# EAGLE design nrf52840bob (EAGLE 8.6.0)
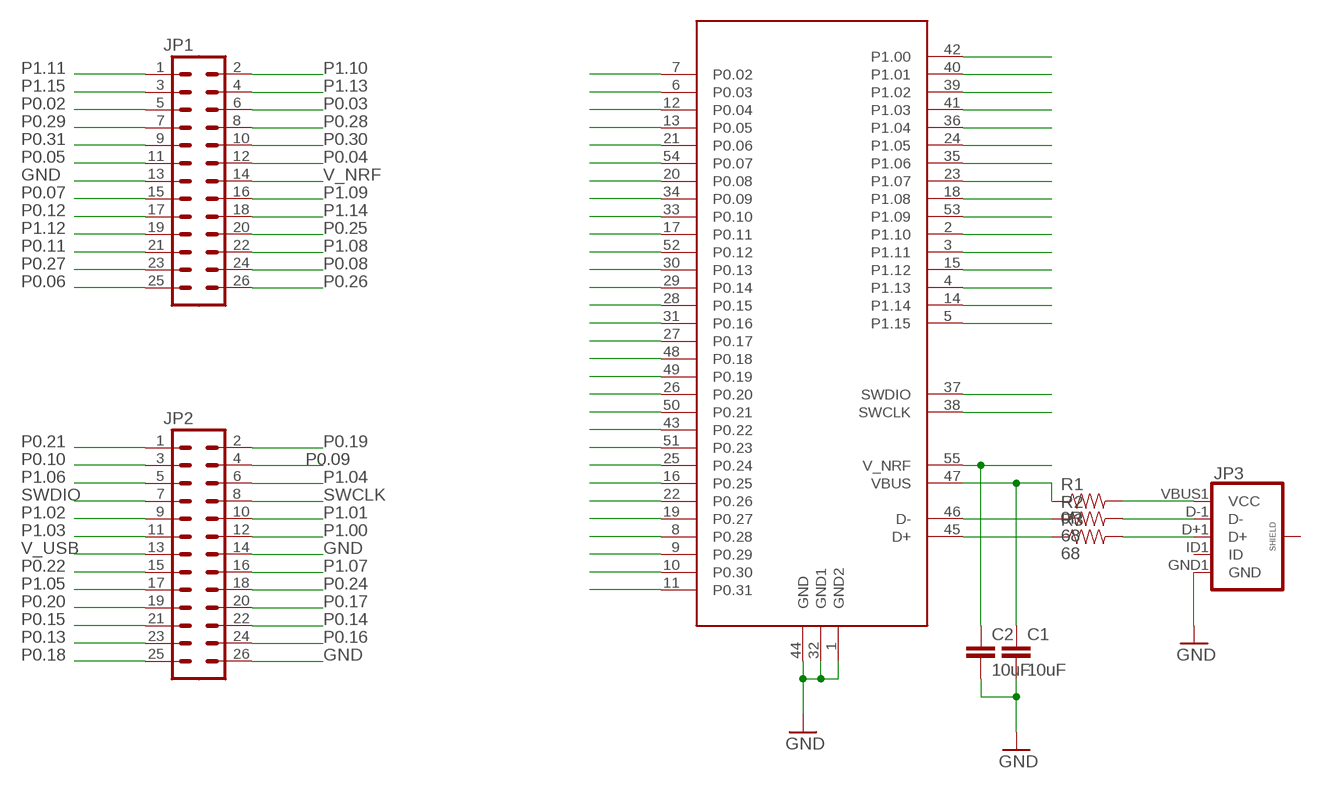
[diagram p0: schematic, sheet 1]

## Parts
C1  10uF  10UF-6.3V-20%(0603)  [0603-CAP]
C2  10uF  10UF-6.3V-20%(0603)  [0603-CAP]
JP1  M13X22X13  [2X13]
JP2  M13X22X13  [2X13]
JP3  USB_MICROB_PLUGCONN-11752  [USB-B-MICRO-SMD_V03]
R1  0R  RESISTOR0603-RES  [0603-RES]
R2  68  RESISTOR0603-RES  [0603-RES]
R3  68  RESISTOR0603-RES  [0603-RES]
U$1  NRF52840  [NRF52840MOD]

## Nets
GND: C1.2 C2.2 JP1.13 JP2.14 JP2.26 JP3.GND1(GND) U$1.1(GND2) U$1.32(GND1) U$1.44(GND)
N$48: R2.1 U$1.46(D-)
N$49: R3.1 U$1.45(D+)
N$50: JP3.D-1(D-) R2.2
N$51: JP3.D+1(D+) R3.2
N$53: C1.1 R1.1 U$1.47(VBUS)
P0.02: JP1.5 U$1.7(P0.02)
P0.03: JP1.6 U$1.6(P0.03)
P0.04: JP1.12 U$1.12(P0.04)
P0.05: JP1.11 U$1.13(P0.05)
P0.06: JP1.25 U$1.21(P0.06)
P0.07: JP1.15 U$1.54(P0.07)
P0.08: JP1.24 U$1.20(P0.08)
P0.09: JP2.4 U$1.34(P0.09)
P0.10: JP2.3 U$1.33(P0.10)
P0.11: JP1.21 U$1.17(P0.11)
P0.12: JP1.17 U$1.52(P0.12)
P0.13: JP2.23 U$1.30(P0.13)
P0.14: JP2.22 U$1.29(P0.14)
P0.15: JP2.21 U$1.28(P0.15)
P0.16: JP2.24 U$1.31(P0.16)
P0.17: JP2.20 U$1.27(P0.17)
P0.18: JP2.25 U$1.48(P0.18)
P0.19: JP2.2 U$1.49(P0.19)
P0.20: JP2.19 U$1.26(P0.20)
P0.21: JP2.1 U$1.50(P0.21)
P0.22: JP2.15 U$1.43(P0.22)
P0.23: U$1.51(P0.23)
P0.24: JP2.18 U$1.25(P0.24)
P0.25: JP1.20 U$1.16(P0.25)
P0.26: JP1.26 U$1.22(P0.26)
P0.27: JP1.23 U$1.19(P0.27)
P0.28: JP1.8 U$1.8(P0.28)
P0.29: JP1.7 U$1.9(P0.29)
P0.30: JP1.10 U$1.10(P0.30)
P0.31: JP1.9 U$1.11(P0.31)
P1.00: JP2.12 U$1.42(P1.00)
P1.01: JP2.10 U$1.40(P1.01)
P1.02: JP2.9 U$1.39(P1.02)
P1.03: JP2.11 U$1.41(P1.03)
P1.04: JP2.6 U$1.36(P1.04)
P1.05: JP2.17 U$1.24(P1.05)
P1.06: JP2.5 U$1.35(P1.06)
P1.07: JP2.16 U$1.23(P1.07)
P1.08: JP1.22 U$1.18(P1.08)
P1.09: JP1.16 U$1.53(P1.09)
P1.10: JP1.2 U$1.2(P1.10)
P1.11: JP1.1 U$1.3(P1.11)
P1.12: JP1.19 U$1.15(P1.12)
P1.13: JP1.4 U$1.4(P1.13)
P1.14: JP1.18 U$1.14(P1.14)
P1.15: JP1.3 U$1.5(P1.15)
SWCLK: JP2.8 U$1.38(SWCLK)
SWDIO: JP2.7 U$1.37(SWDIO)
V_NRF: C2.1 JP1.14 U$1.55(V_NRF)
V_USB: JP2.13 JP3.VBUS1(VCC) R1.2
Unconnected: JP3.ID1(ID) JP3.SHIELD1(SHIELD) JP3.SHIELD2(SHIELD) JP3.SHIELD3(SHIELD)

## Library data of the parts
C1 C2 = SparkFun-Capacitors:10UF-6.3V-20%(0603): CAP-11015; PROD_ID: CAP-11015
JP1 JP2 = SparkFun-Connectors:M13X2: 0.1" spaced headers
JP3 = SparkFun-Connectors:USB_MICROB_PLUG: USB Micro-B connectors Some male, some female. Watch your step!; PROD_ID: CONN-11752
R1-R3 = SparkFun-Passives:RESISTOR: Resistor Basic schematic elements and footprints for 0603, 1206, and PTH resistors.
U$1 = nrf52840mod:NRF52840

## Board
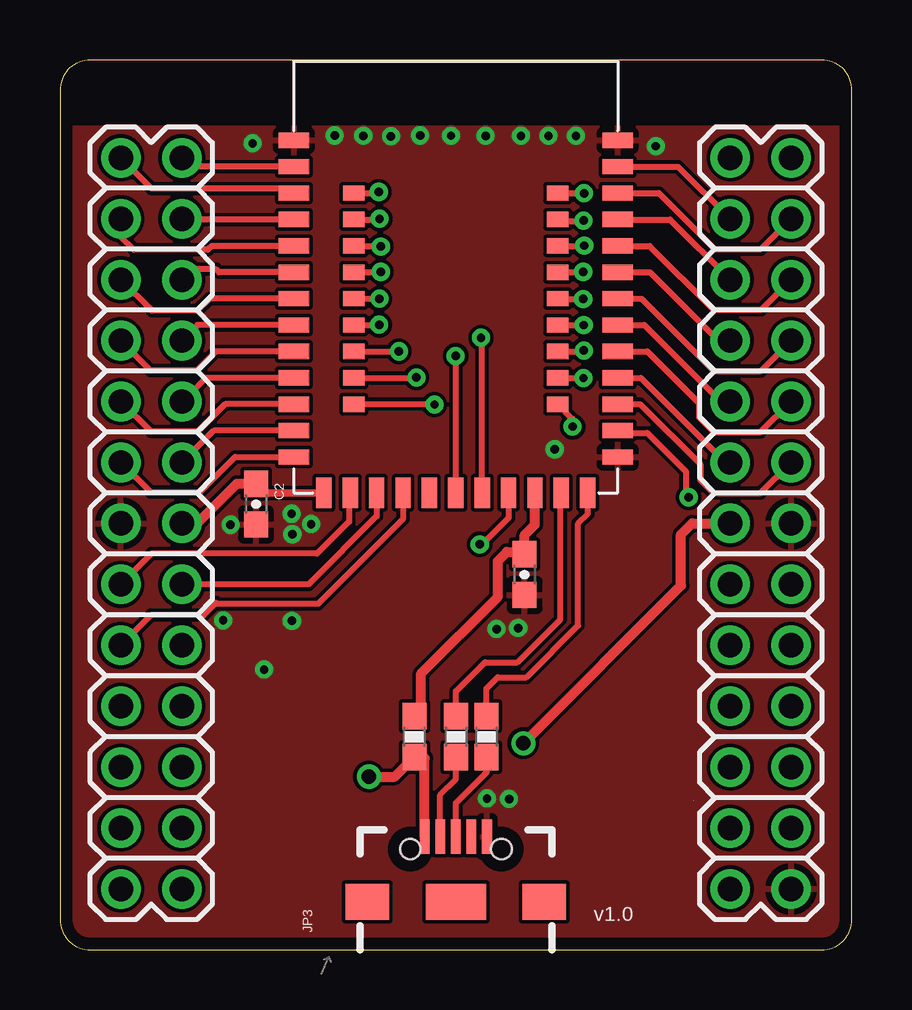
[diagram p1: board, top side]
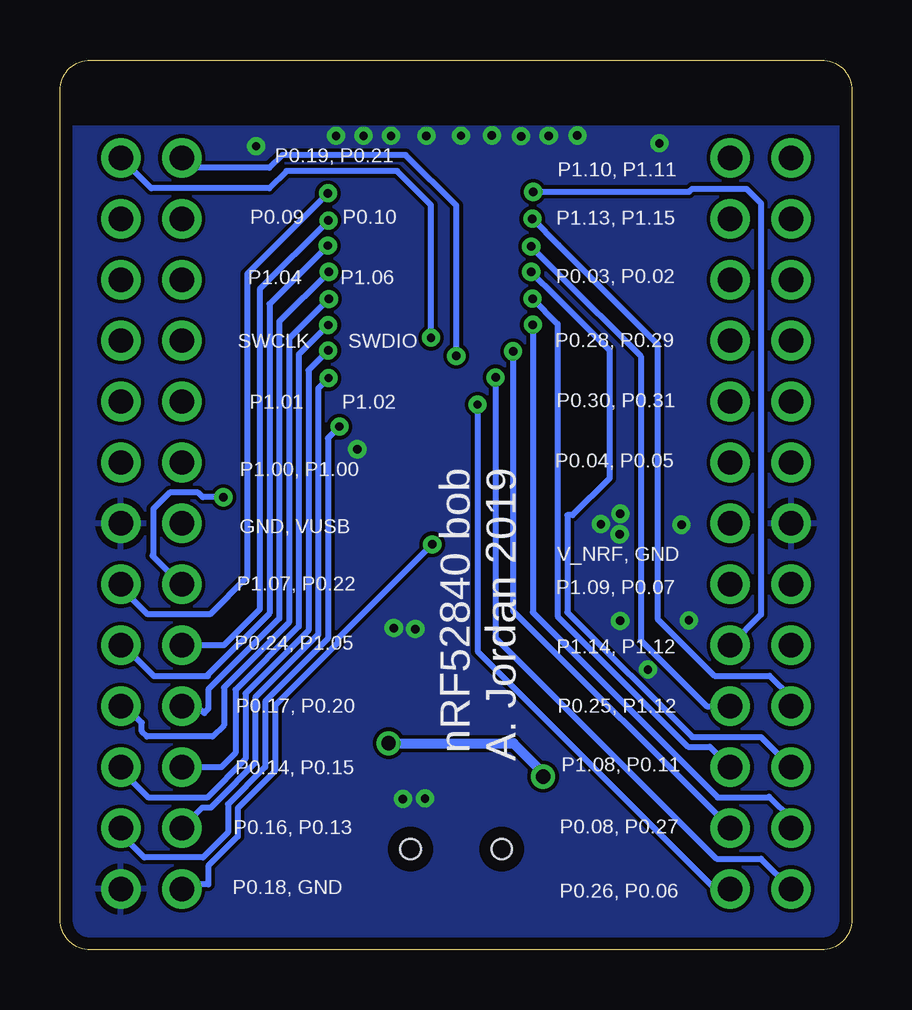
[diagram p2: board, bottom side, seen from below]

Size 33.02 x 37.1 mm. Coordinates in mm from the lower left corner, seen from the top.
Outline: 33.02,1.27 33.02,35.83 arc90 31.75,37.1 1.27,37.1 arc90 0,35.83 0,1.27 arc90 1.27,0 31.75,0 arc90 33.02,1.27
Copper layers (1*16): Top 0.035mm / dielectric 1.5mm / Bottom 0.035mm
Design rules "default *": minimum track width 6mil, minimum drill 0.35mm, track to track 6mil, track to pad 6mil, pad to pad 6mil, via to via 6mil, smd to smd 6mil, copper to edge 20mil, drill to drill 6mil, minimum pad ring 10mil, minimum via ring 8mil, stop-mask expansion 4mil, vias tented up to drill 20mil, thermal gap 10mil

### Footprints (pad centres in the part's own frame; a part is rotated, then mirrored left to right if it is on the bottom)
0603-CAP = smd 1.1 x 1: 1 -0.85,0; 2 0.85,0
2X13 = drill 1.016 pad 1.651: 1 0,0; 2 0,2.54; 3 2.54,0; 4 2.54,2.54; 5 5.08,0; 6 5.08,2.54; 7 7.62,0; 8 7.62,2.54; 9 10.16,0; 10 10.16,2.54; 11 12.7,0; 12 12.7,2.54; 13 15.24,0; 14 15.24,2.54; 15 17.78,0; 16 17.78,2.54; 17 20.32,0; 18 20.32,2.54; 19 22.86,0; 20 22.86,2.54; 21 25.4,0; 22 25.4,2.54; 23 27.94,0; 24 27.94,2.54; 25 30.48,0; 26 30.48,2.54
USB-B-MICRO-SMD_V03 = smd 1.45 x 0.4: D+1 2.725,0; D-1 2.725,0.65; GND1 2.725,-1.3; ID1 2.725,-0.65; VBUS1 2.725,1.3 | smd 1.5 x 1.8: SHIELD1 0,3.685; SHIELD2 0,-3.685 | smd 1.5 x 2.5: SHIELD3 0,0 | hole 0.85: 2.2,1.9; 2.2,-1.9
0603-RES = smd 1.1 x 1: 1 -0.85,0; 2 0.85,0
NRF52840MOD = smd 1.27 x 0.635: 1 0,14.7; 2 0,13.6; 3 0,12.5; 4 0,11.4; 5 0,10.3; 6 0,9.2; 7 0,8.1; 8 0,7; 9 0,5.9; 10 0,4.8; 11 0,3.7; 12 0,2.6; 13 0,1.5; 32 13.5,14.7; 33 13.5,13.6; 34 13.5,12.5; 35 13.5,11.4; 36 13.5,10.3; 37 13.5,9.2; 38 13.5,8.1; 39 13.5,7; 40 13.5,5.9; 41 13.5,4.8; 42 13.5,3.7; 43 13.5,2.6; 44 13.5,1.5; P$7 0,8.1; P$32 13.5,8.1 | smd 0.9 x 0.635: 14 2.5,12.5; 15 2.5,11.4; 16 2.5,10.3; 17 2.5,9.2; 18 2.5,8.1; 19 2.5,7; 20 2.5,5.9; 21 2.5,4.8; 22 2.5,3.7; 23 11,12.5; 24 11,11.4; 25 11,10.3; 26 11,9.2; 27 11,8.1; 28 11,7; 29 11,5.9; 30 11,4.8; 31 11,3.7 | smd 0.635 x 1.27: 45 12.25,0; 46 11.15,0; 47 10.05,0; 48 8.95,0; 49 7.85,0; 50 6.75,0; 51 5.65,0; 52 4.55,0; 53 3.45,0; 54 2.35,0; 55 1.25,0

### Placement (x,y rotation side)
C1  19.37,15.65 270 top
C2  8.18,18.58 270 top
JP1  2.54,33.02 270 top
JP2  27.94,33.02 270 top
JP3  16.5,2 90 top
R1  14.77,8.89 270 top
R2  16.51,8.89 270 top
R3  17.78,8.89 270 top
U$1  9.75,19.05 0 top

### Tracks (layer width: path | path; a pad name or v marks a point on that pad's centre or on a via)
GND  (via drill 0.35)
  other vias: 8.03,33.63 24.84,33.51 7.11,17.72 9.67,13.72 9.66,18.19 9.69,17.33 10.47,17.75 8.51,11.69 18.2,13.38 19.1,13.42 20.63,20.87 17.8,6.32 18.72,6.29 6.8,13.74 11.45,33.95 12.64,33.94 13.8,33.92 15.01,33.95 16.3,33.94 17.74,33.94 19.22,33.94 20.37,33.94 21.51,33.94
  pour Top: -1.27,34.29 -1.27,-1.27 34.29,-1.27 34.29,34.29
  pour Bottom: -2.54,34.29 -2.54,-2.54 35.56,-2.54 35.56,34.29
N$48
  Top 0.254: R2.1 16.51,10.78 17.72,11.99 19.07,11.99 20.86,13.77 20.86,19 U$1.46
N$49
  Top 0.254: R3.1 17.78,10.9 18.25,11.37 19.44,11.37 21.6,13.53 21.6,17.77 22,18.18 U$1.45
N$50
  Top 0.254: JP3.D-1 15.85,6.46 16.51,7.12 R2.2
N$51
  Top 0.254: JP3.D+1 16.5,6.12 17.79,7.41 R3.2
N$53
  Top 0.406: R1.1 15.06,10.02 15.06,11.52 18.25,14.72 18.25,16.21 18.63,16.59 19.34,16.59 C1.1 19.37,17.3 19.8,17.73 U$1.47
P0.02
  Top 0.254: U$1.7 6.23,27.15 5.73,26.64 3.84,26.64 JP1.5
P0.03
  Top 0.254: U$1.6 6.63,28.25 6.5,28.38 5.52,28.38 JP1.6
P0.04
  Top 0.254: U$1.12 6.41,21.65 JP1.12
P0.05
  Top 0.254: JP1.11 3.78,19.08 5.83,19.08 7.31,20.55 U$1.13
P0.06  (via drill 0.35)
  Top 0.254: U$1.21 14.88,23.85 14.9,23.86 v14.86,23.86
  Bottom 0.254: v14.86,23.86 14.86,13.01 5.65,3.8 3.8,3.8 JP1.25
P0.07
  Top 0.254: U$1.54 12.06,19.01 12.06,17.86 10.72,16.52 3.82,16.52 JP1.15
P0.08  (via drill 0.35)
  Top 0.254: U$1.20 v14.13,24.95
  Bottom 0.254: v14.13,24.95 14.13,14.13 JP1.24
P0.09
  Top 0.254: U$1.34 24.97,31.55 27.3,29.22 29.22,29.22 JP2.4
P0.10
  Top 0.254: U$1.33 25.77,32.65 JP2.3
P0.11  (via drill 0.35)
  Top 0.254: U$1.17 13.36,28.25 v13.38,28.27
  Bottom 0.254: v13.38,28.27 12.32,27.21 12.22,27.11 10.11,25 10.11,19.66 11.65,18.12 11.87,18.12 11.87,14.07 6.67,8.87 3.79,8.87 JP1.21
P0.12
  Top 0.254: U$1.52 14.3,17.96 10.77,14.43 6.55,14.43 6.51,14.47 5.99,13.96 3.8,13.96 JP1.17
P0.13  (via drill 0.35)  (1 unrouted)
  Top 0.254: U$1.30 21.8,23.85 21.81,23.86 21.81,23.82 v21.82,23.84
  Bottom 0.254: v21.82,23.84 22.25,23.41 22.25,13.14 24.87,10.52 24.87,7.79 26.42,6.24 26.73,5.94 27.08,5.94 JP2.23
P0.14  (via drill 0.35)
  Top 0.254: U$1.29 21.8,24.95 v21.84,24.99
  Bottom 0.254: v21.84,24.99 22.66,24.17 22.66,13.31 25.28,10.69 25.28,7.96 26.89,6.35 29.32,6.35 30.48,7.51 JP2.22
P0.15  (via drill 0.35)
  Top 0.254: U$1.28 v21.84,26.05
  Bottom 0.254: v21.84,26.05 23.06,24.82 23.06,13.48 25.7,10.85 25.7,8.21 26.29,7.62 JP2.21
P0.16  (via drill 0.35)
  Top 0.254: U$1.31 21.37,22.13 v21.37,21.82
  Bottom 0.254: v21.37,21.82 21.84,21.34 21.84,12.98 24.47,10.35 24.47,7.62 26.02,6.08 26.02,4.89 27.05,3.86 29.51,3.86 30.48,4.83 JP2.24
P0.17  (via drill 0.35)
  Top 0.254: U$1.27 20.76,27.14 v21.81,27.14
  Bottom 0.254: v21.81,27.14 23.47,25.48 23.47,13.65 26.18,10.94 26.18,9.37 26.66,8.89 29.39,8.89 29.61,9.11 29.61,9.47 30.3,10.16 JP2.20
P0.18  (via drill 0.35)
  Top 0.254: U$1.48 18.7,18.01 17.6,16.91 v17.5,16.91
  Bottom 0.254: v17.5,16.91 21.44,12.97 21.44,12.81 24.06,10.18 24.06,7.46 25.61,5.91 25.61,4.73 26.84,3.5 26.84,2.73 27.75,2.73 JP2.25
P0.19  (via drill 0.35)
  Top 0.254: U$1.49 17.6,25.48 v17.55,25.52
  Bottom 0.254: v17.55,25.52 17.55,31.05 18.97,32.47 23.44,32.47 23.57,32.47 24.29,31.75 29.21,31.75 JP2.2
P0.20  (via drill 0.35)
  Top 0.254: U$1.26 21.8,28.25 v21.81,28.26
  Bottom 0.254: v21.81,28.26 23.88,26.2 23.88,13.82 26.84,10.86 26.84,10.05 27.01,9.88 27.29,10.16 JP2.19
P0.21  (via drill 0.35)
  Top 0.254: U$1.50 16.5,24.89 v16.5,24.76
  Bottom 0.254: v16.5,24.76 16.5,31.03 18.61,33.14 23.75,33.14 24.29,32.6 27.52,32.6 JP2.1
P0.22  (via drill 0.35)
  Top 0.254: U$1.43 23.35,21.55 24.49,21.55 26.1,19.94 26.1,19.06 26.21,18.95 v26.21,18.87
  Bottom 0.254: v26.21,18.87 27.07,18.87 27.26,19.06 28.45,19.06 29.13,18.39 29.13,16.48 29.17,16.44 27.97,15.24 JP2.15
P0.24  (via drill 0.35)
  Top 0.254: U$1.25 21.82,29.35 21.83,29.36 v21.85,29.36
  Bottom 0.254: v21.85,29.36 24.28,26.93 24.28,14.03 26.86,11.46 26.86,11.41 29.1,11.41 30.39,12.7 JP2.18
P0.25  (via drill 0.35)
  Top 0.254: U$1.16 13.35,29.35 v13.38,29.32
  Bottom 0.254: v13.38,29.32 12.28,28.22 8.81,24.75 8.81,12.91 6.06,10.16 JP1.20
P0.26  (via drill 0.35)
  Top 0.254: U$1.22 15.62,22.75 15.64,22.74 v15.61,22.74
  Bottom 0.254: v15.61,22.74 15.61,12.44 5.64,2.47 5.57,2.54 JP1.26
P0.27  (via drill 0.35)
  Top 0.254: U$1.19 13.29,26.05 v13.31,26.07
  Bottom 0.254: v13.31,26.07 13.31,14.07 5.59,6.36 3.48,6.36 3.46,6.38 2.54,5.46 JP1.23
P0.28
  Top 0.254: U$1.8 5.73,26.05 JP1.8
P0.29
  Top 0.254: U$1.9 6.5,24.95 5.7,24.15 3.79,24.15 JP1.7
P0.30
  Top 0.254: U$1.10 6.07,23.85 JP1.10
P0.31
  Top 0.254: U$1.11 6.89,22.75 5.75,21.61 3.79,21.61 JP1.9
P1.00
  Top 0.254: U$1.42 24.19,22.75 26.69,20.25 26.69,19.59 27.24,19.05 29.21,19.05 JP2.12
P1.01
  Top 0.254: U$1.40 24.47,24.95 24.47,24.96 26.64,22.79 26.64,22.21 27.27,21.59 29.21,21.59 JP2.10
P1.02
  Top 0.254: U$1.39 24.36,26.05 27.55,22.86 JP2.9
P1.03
  Top 0.254: U$1.41 24.21,23.85 27.74,20.32 JP2.11
P1.04
  Top 0.254: U$1.36 24.58,29.35 27.23,26.7 29.24,26.7 JP2.6
P1.05  (via drill 0.35)
  Top 0.254: U$1.24 20.81,30.39 21.85,30.39 | 21.85,30.39 | 21.85,30.39 v21.83,30.41
  Bottom 0.254: v21.83,30.41 24.69,27.55 24.69,14.2 26.19,12.7 JP2.17
P1.06
  Top 0.254: U$1.35 25.43,30.45 JP2.5
P1.07  (via drill 0.35)
  Top 0.254: U$1.23 21.76,31.55 21.78,31.58 21.82,31.54 v21.85,31.54
  Bottom 0.254: v21.85,31.54 25.21,28.18 25.21,15.54 26.77,13.99 29.36,13.99 30.48,15.11 JP2.16
P1.08  (via drill 0.35)
  Top 0.254: U$1.18 13.36,27.15 | 13.36,27.15 | 13.36,27.15 13.36,27.14 v13.32,27.14
  Bottom 0.254: JP1.22 5.93,8.47 6.83,8.47 12.27,13.9 12.27,22.79 12.27,23.74 12.27,25.1 12.27,26.1 v13.32,27.14
P1.09
  Top 0.254: U$1.53 13.2,18.08 10.36,15.24 JP1.16
P1.10
  Top 0.254: U$1.2 5.45,32.65 JP1.2
P1.11
  Top 0.254: U$1.3 9.55,31.75 3.81,31.75 JP1.1
P1.12  (via drill 0.35)
  Top 0.254: U$1.15 13.3,30.45 v13.32,30.48
  Bottom 0.254: v13.32,30.48 12.23,29.39 8.11,25.27 8.11,13.8 5.73,11.43 3.44,11.43 2.54,10.52 JP1.19
P1.13
  Top 0.254: U$1.4 5.11,30.45 JP1.4
P1.14  (via drill 0.35)
  Top 0.254: U$1.14 13.32,31.55 13.34,31.57 13.31,31.6 v13.29,31.6
  Bottom 0.254: v13.29,31.6 6.79,31.6 6.66,31.73 4.4,31.73 3.8,31.13 3.8,13.98 JP1.18
P1.15
  Top 0.254: U$1.5 6.33,29.35 6.17,29.18 3.08,29.18 2.54,29.73 JP1.3
SWCLK
  Top 0.254: U$1.38 24.25,27.15 27.27,24.13 29.21,24.13 JP2.8
SWDIO
  Top 0.254: U$1.37 24.6,28.25 27.45,25.4 JP2.7
V_NRF
  Top 0.305: U$1.55 8.56,19.05 C2.1
  Top 0.406: JP1.14 5.72,17.78 7.38,19.43 C2.1
V_USB  (via drill 0.6)
  Top 0.406: JP3.VBUS1 15.2,8 R1.2 13.95,7.22 v12.88,7.22 | v19.32,8.62 25.89,15.19 25.89,17.32 26.35,17.78 JP2.13
  Bottom 0.406: v19.32,8.62 14.11,8.62 12.81,7.32 12.88,7.25 v12.88,7.22

### Text on the board
tPlace: v1.0
bPlace: P0.19, P0.21 | P1.10, P1.11 | P1.13, P1.15 | P0.09 P0.10 | P0.03, P0.02 | P1.04 P1.06 | P0.28, P0.29 | SWCLK SWDIO | P0.30, P0.31 | P1.01 P1.02 | P0.04, P0.05 | nRF52840 bob / A. Jordan 2019 | P1.00, P1.00 | GND, VUSB | V_NRF, GND | P1.09, P0.07 | P1.07, P0.22 | P0.24, P1.05 | P1.14, P1.12 | P0.25, P1.12 | P0.17, P0.20 | P1.08, P0.11 | P0.14, P0.15 | P0.08, P0.27 | P0.16, P0.13 | P0.26, P0.06 | P0.18, GND